# Altium schematic sheet Adafruit_TPS61040_Boost_Converter.SchDoc: Adafruit_TPS61040_Boost_Converter
size 282 x 211 mm; Origin: Eagle; SheetNumber: 1; COMPANY: COMPANY; DRAWN: DRAWN; Date: 11/11/2025 10:38:10 PM; REV: REV; GateName_1: G$1; SymbolName_1: FRAME_A4; LibraryName: microbuilder; DeviceSetName: FRAME_A4; GateName_2: G$3; SymbolName_2: FRAME_DOCFIELD; DRG: DRG; o: o; N: N; YEAR: >YEAR; C: C; ISSUE: ISSUE; FILE: FILE:; PAGE: PAGE:; CHECKED: CHECKED; DRGNO: >DRGNO
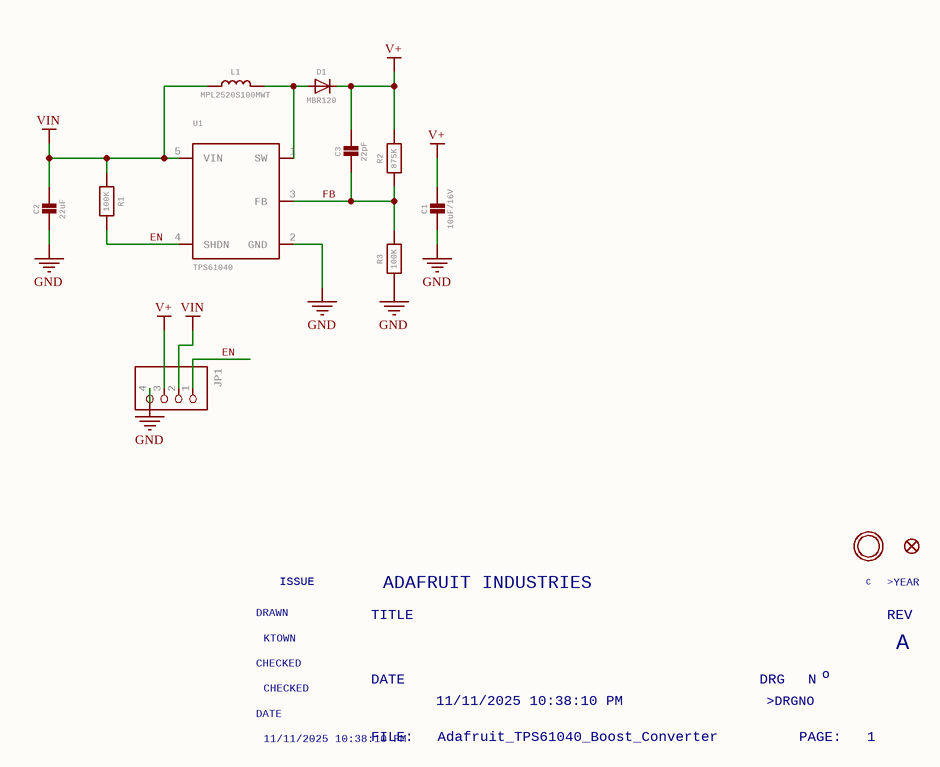
[diagram p0: Adafruit_TPS61040_Boost_Converter.SchDoc]

## Parts
C1  10uF/16V  [0805-NO]
C2  22uF  [0805-NO]
C3  22pF  [0603-NO]
D1  MBR120  [SOD-123FL]
FID1  FIDUCIAL_1MM  [FIDUCIAL_1MM]  (value not drawn)
JP1  HEADER-1X4ROUND  [1X04_ROUND]  (value not drawn)
L1  MPL2520S100MWT  [INDUCTOR_1007]
R1  100K  [0603-NO]
R2  875K  [0603-NO]
R3  100K  [0603-NO]
U1  TPS61040  [SOT23-5]
U$9  MOUNTINGHOLE2.5  [MOUNTINGHOLE_2.5_PLATED]  (value not drawn)

## Nets
GND: C1.2 C2.2 JP1.4 R3.1 U1.2(GND)
V+: C1.1 C3.1 D1.C JP1.3 R2.2
VIN: C2.1 JP1.2 L1.P$1 R1.1 U1.5(VIN)
EN: JP1.1 R1.2 U1.4(SHDN)
FB: C3.2 R2.1 R3.2 U1.3(FB)
NetD1_A: D1.A L1.P$2 U1.1(SW)

## Notes on the sheet
- DRAWN
- KTOWN
- ISSUE
- TITLE
- ADAFRUIT INDUSTRIES
- C
- REV
- >YEAR
- CHECKED
- DATE
- 11/11/2025 10:38:10 PM
- DRG
- >DRGNO
- N
- o
- A
- FILE:
- Adafruit_TPS61040_Boost_Converter
- PAGE:
- 1

## Library data of the parts
C1 C2 = CAP_CERAMIC0805-NOOUTLINE: Ceramic Capacitors   For new designs, use the packages preceded by an '_' character since they are more reliable:   The following footprints should be used on most boards: _0402 - Standard footprint for regular board layouts  _0603 - Standard footprint for regular board layouts  _0805 - Standard footprint for regular board layouts  _1206 - Standard footprint for regular board layouts       For extremely tight-pitch boards where space is at a premium, the following 'micro-pitch' footprints can be used (smaller pads, no silkscreen outline, etc.): _0402MP - Micro-pitch footprint for very dense/compact boards  _0603MP - Micro-pitch footprint for very dense/compact boards  _0805MP - Micro-pitch footprint for very dense/compact boards  _1206MP - Micro-pitch footprint for very dense/compact boards; GateName_1: G$1; SymbolName_1: CAPACITOR; DeviceName: 0805-NOOUTLINE; LibraryName: microbuilder; DeviceSetName: CAP_CERAMIC
C3 = CAP_CERAMIC0603_NO: Ceramic Capacitors   For new designs, use the packages preceded by an '_' character since they are more reliable:   The following footprints should be used on most boards: _0402 - Standard footprint for regular board layouts  _0603 - Standard footprint for regular board layouts  _0805 - Standard footprint for regular board layouts  _1206 - Standard footprint for regular board layouts       For extremely tight-pitch boards where space is at a premium, the following 'micro-pitch' footprints can be used (smaller pads, no silkscreen outline, etc.): _0402MP - Micro-pitch footprint for very dense/compact boards  _0603MP - Micro-pitch footprint for very dense/compact boards  _0805MP - Micro-pitch footprint for very dense/compact boards  _1206MP - Micro-pitch footprint for very dense/compact boards; GateName_1: G$1; SymbolName_1: CAPACITOR; DeviceName: 0603_NO; LibraryName: microbuilder; DeviceSetName: CAP_CERAMIC
D1 = DIODE_MINISOD123: Diode    SMA      Model	  Volts	  Amps	  Type	  Vf	  Ir	  Digikey #	  Notes	     SSA34-E3	  40V	  3A	  Schottky	  480mV @ 3A	  200uA @ 40V	  SSA34-E3/61TGITR-ND	  	     CDBA120-G	  20V	  1A	  Schottky	  500mV @ 1A	  500uA @ 20V	  641-1014-6-ND	  REEL	     MBRA210	  10V	  2A	  Schottky	  350mV @ 2A	  700uA @ 10V	  MBRA210LT3	  	 SOD-123      Model	  Volts	  Amps	  Type	  Vf	  Ir	  Order #	  Notes	     BAT54T1G	  30V	  200mA	  Schottky	  800mV @ 200mA	  2uA @ 25V	  BAT54T1GOSTR-ND	  	     B0530W	  30V	  500mA	  Schottky	  430mV @ 500mA	  130uA @ 30V	  B0530W-FDICT-ND	  REEL	     MBR120	  20V	  1A	  Schottky	  340mV @ 1A	  	  MBR120VLSFT1GOSCT-ND	  	 SOD-323      Model	  Volts	  Amps	  Type	  Vf	  Ir	  Order #	  Notes	     PMEG2005EJ	  20V	  500mA	  Schottky	  355mV @ 500mA	  	  568-4110-1-ND	  	     ZLLS410	  10V	  570mA	  Schottky	  380mV @ 570mA	  	  ZLLS410CT-ND	  	     1N4148WS	  75V	  150mA	  Silicon/Simple	  1V	  	  1N4148WSFSCT-ND	  REEL	 SOD-523      Model	  Volts	  Amps	  Type	  Vf	  Ir	  Order #	  Notes	     BAT54XV2	  30V	  200mA	  Schottky	  0.8V @ 100mA	  	  BAT54XV2CT-ND	  	     TB751S	  30V	  30mA	  Schottky	  	  	  RB751S-40TE61CT-ND	  	 SOT23-R/W (R = Solder Paste/Reflow Ovens, W = Hand-Soldering)       Model	  Volts	  Amps	  Type	  Vf	  Ir	  Order #	  Notes	     BAT54FILM	  40V	  300mA	  Schottky	  	  	  497-7162-1-ND	  	 POWERDI-5       Model	  Volts	  Amps	  Type	  Vf	  Ir	  Order #	  Notes	     PDS560	  60V	  5A	  Schottky	  670mV @ 5A	  150uA @ 60V	  PDS560DICT-ND; GateName_1: G$1; SymbolName_1: DIODE; DeviceName: _MINISOD123; LibraryName: microbuilder; DeviceSetName: DIODE
FID1 = FIDUCIAL_1MM: Fiducial Alignment Points   Various fiducial points for machine vision alignment.; GateName_1: G$1; DeviceName: _1MM; BOM: EXCLUDE; SymbolName_1: FIDUCIAL; LibraryName: microbuilder; DeviceSetName: FIDUCIAL
JP1 = HEADER-1X4ROUND: PIN HEADER; GateName_1: A; SymbolName_1: PINHD4; DeviceName: ROUND; LibraryName: microbuilder; DeviceSetName: HEADER-1X4
L1 = INDUCTOR: Inductors   0603: 10nH Ceramic Inductor - microwire antenna/RF (Digikey: 712-1434-2-ND)       0805: 560nH Ceramic Inductor - RF (Digikey: 553-1047-1-ND)  270nH Ceramic Inductor - Q = 40@250MHz, +-5%, 1 Ohm DC Resistance (Digikey: 535-10506-2-ND)       1007 (2518 Metric) SMT: 10ÂµH 10% 250mOhm 820mA 1007 Inductor (Digikey: 587-2189-1-ND)  22ÂµH 10% 500mOhm 580mA 1007 Inductor (Digikey: 587-2190-1-ND)  47ÂµH 10% 950mOhm 420mA 1007 Inductor (Digikey: 587-2191-1-ND)  47ÂµH 5% 100mOhm 1A 1008 Inductor (Digikey: 732-1816-1-ND)       5.0x5.0mm (Taiyo Yuden NR5040 Series) 6.8ÂµH 20% 2.3A 64mOhm Inductor (Digikey: 587-2374-2-ND)       5.0x5.0mm (TDK VLC5045 Series) 4.7ÂµH 20% 3.3A 34mOhm Inductor (Digikey: 445-6526-1-ND)  6.8ÂµH 20% 2.7A 46mOhm Inductor (Digikey: 445-6527-1-ND)       6.0x6.0mm (TDK VLC6045 Series) 4.7ÂµH 20% 3.8A 27mOhm Inductor (Digikey: 445-6538-2-ND)  6.8ÂµH 20% 3A 41mOhm Inductor (Digikey: 445-6540-1-ND)  6.2ÂµH 30% 2.2A 45mOhm Inductor (Digikey: SRR5028-6R2YCT-ND) - Not TDK VLC6045 but footprint should match       6.0x6.0mm (TDK SLF6045 Series) 6.8uH 30% 2A 33mOhm Inductor (Digikey: 445-4572-1-ND, Mouser: 810-SLF645T6R8N2R0PF)       6.0x6.0mm (Sumida CDRH5D28 Series) 6.2uH 30% 1.8A 45mOhm Inductor (Digikey: 308-1542-1-ND)       Taiyo Yuden NR3015T2R2M - 2.2uH 20% 1.5A (Digikey: 587-1648-2-ND, Mouser: 963-NR3015T2R2M) - Used with TI TPS62172   CoilCraft RFID Transponder Coil - MA5532-AE (For use with AS3935 Lightning Sensor)   Taiyo Yuden NRH2412T2R2MNGH - 2.2uH 20% 1AA (Digikey: 587-3443-1-ND) - Used with TI LM3671   Vishay IHLP  1.0uH Molded Inductor - 24mOhm DCR, 5A, +/-20%, -55Â°C-125Â°C (Digikey: 541-1319-1-ND); GateName_1: G$1; SymbolName_1: INDUCTOR; LibraryName: microbuilder; DeviceSetName: INDUCTOR
R1-R3 = RESISTOR_0603_NOOUT: Resistors   For new designs, use the packages preceded by an '_' character since they are more reliable:   The following footprints should be used on most boards: _0402 - Standard footprint for regular board layouts  _0603 - Standard footprint for regular board layouts  _0805 - Standard footprint for regular board layouts  _1206 - Standard footprint for regular board layouts       For extremely tight-pitch boards where space is at a premium, the following 'micro-pitch' footprints can be used (smaller pads, no silkscreen outline, etc.): _0402MP - Micro-pitch footprint for very dense/compact boards  _0603MP - Micro-pitch footprint for very dense/compact boards  _0805MP - Micro-pitch footprint for very dense/compact boards  _1206MP - Micro-pitch footprint for very dense/compact boards; GateName_1: G$1; SymbolName_1: RESISTOR; DeviceName: _0603_NOOUT; LibraryName: microbuilder; DeviceSetName: RESISTOR
U1 = VREG_FAN5331: FAN5331 - LED/OLED 20V Boost Converter   Digikey: FAN5331SXCT-ND; GateName_1: G$1; SymbolName_1: FAN533X; LibraryName: adafruit_power; DeviceSetName: VREG_FAN5331
U$9 = MOUNTINGHOLE2.5: Mounting Hole   For #2 screws (0.086"/2.18mm width, 0.094"/2.4mm hole) use 2.5mm; GateName_1: G$1; DeviceName: 2.5; BOM: EXCLUDE; SymbolName_1: MOUNTINGHOLE; LibraryName: microbuilder; DeviceSetName: MOUNTINGHOLE